# Altium schematic sheet Power.SchDoc
size A
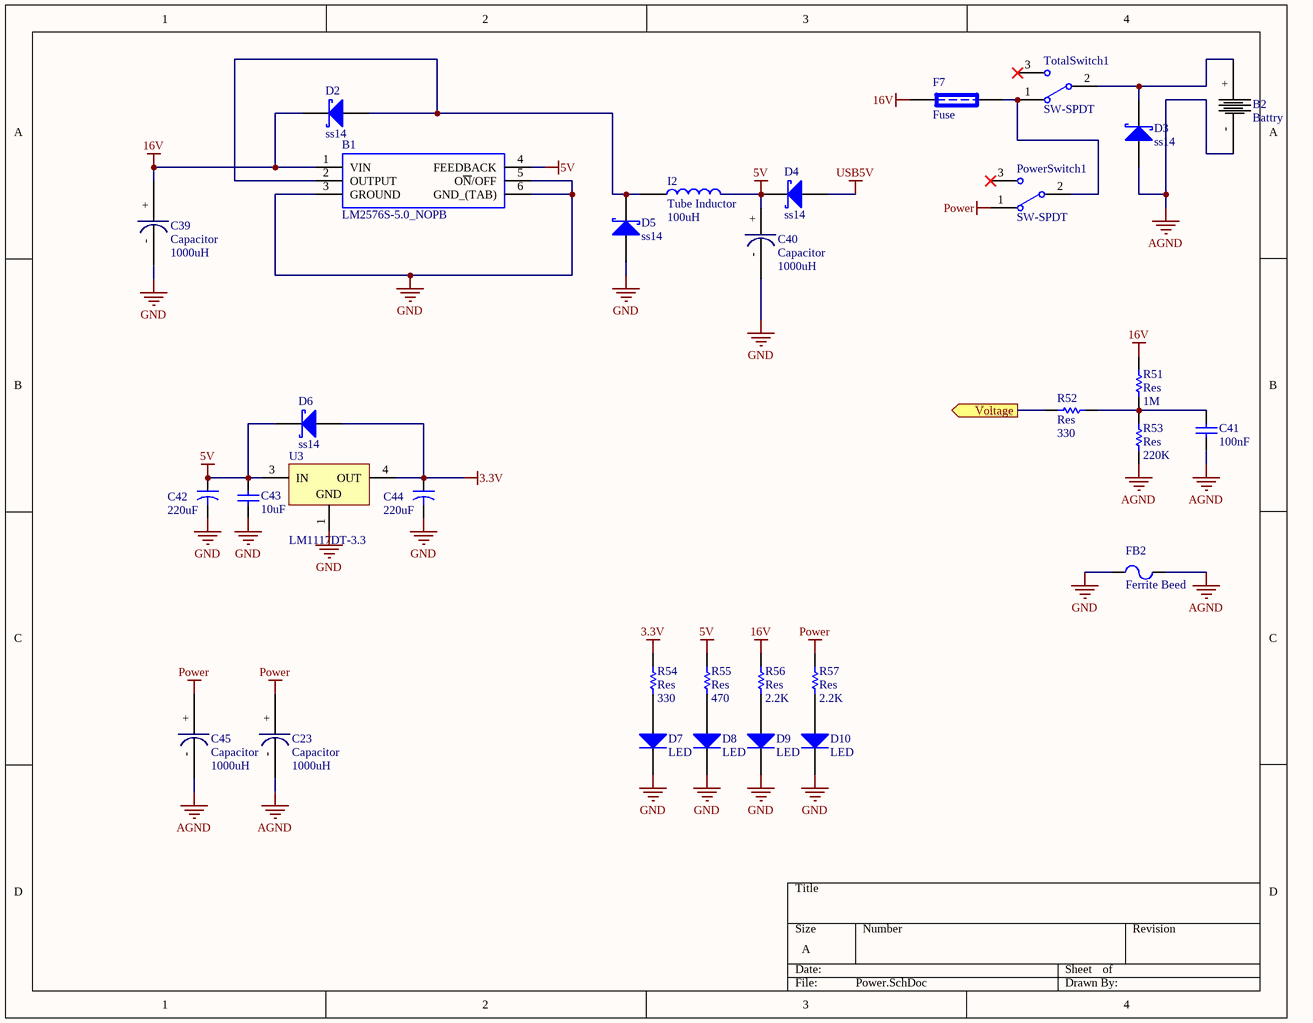
[diagram p0: Power.SchDoc]

## Parts
B1  LM2576S-5.0_NOPB  [TO170P1435X465-6N]
B2  Battry  [Battry]
C23  Capacitor  Capacitance: 1000uH  [DIPCap]
C39  Capacitor  Capacitance: 1000uH  [DIPCap]
C40  Capacitor  Capacitance: 1000uH  [DIPCap]
C41  value 100nF  [2012[0805]]  (hidden comment: Cap_UP)
C42  value 220uF  [7343]  (hidden comment: Cap_El)
C43  value 10uF  [2012[0805]]  (hidden comment: Cap_UP)
C44  value 220uF  [7343]  (hidden comment: Cap_El)
C45  Capacitor  Capacitance: 1000uH  [DIPCap]
D2  ss14  [US1m]
D3  ss14  [US1m]
D4  ss14  [US1m]
D5  ss14  [US1m]
D6  ss14  [US1m]
D7  LED  [2012[0805]]
D8  LED  [2012[0805]]
D9  LED  [2012[0805]]
D10  LED  [2012[0805]]
F7  Fuse  [3216[1206]]
FB2  Ferrite Beed  [3216[1206]]
I2  Tube Inductor  Inductance: 100uH  [Tube_Inductor]
PowerSwitch1  SW-SPDT  [KEYKHRAB]
R51  Res  value 1M  [2012[0805]]
R52  Res  value 330  [2012[0805]]
R53  Res  value 220K  [2012[0805]]
R54  Res  value 330  [2012[0805]]
R55  Res  value 470  [2012[0805]]
R56  Res  value 2.2K  [2012[0805]]
R57  Res  value 2.2K  [2012[0805]]
TotalSwitch1  SW-SPDT  [KEYKHRAB]
U3  LM1117DT-3.3  [SOT223]

## Ports
Voltage (out)

## Nets
3.3V: C44.1 D6.1(A) R54.2 U3.4(OUT)
5V: B1.4(FEEDBACK) C40.+ C42.1 C43.2 D4.2(K) D6.2(K) I2.1 R55.2 U3.3(IN)
16V: B1.1(VIN) C39.+ D2.2(K) F7.1 R51.2 R56.2
AGND: B2.- C23.- C41.1 C45.- D3.1(A) FB2.2 R53.1
GND: B1.3(GROUND) B1.5(O~{N}/OFF) B1.6(GND_(TAB)) C39.- C40.- C42.2 C43.1 C44.2 D5.1(A) D7.2(K) D8.2(K) D9.2(K) D10.2(K) FB2.1 U3.1(GND)
Power: C23.+ C45.+ PowerSwitch1.1 R57.2
USB5V: D4.1(A)
Voltage: R52.1 ; port Voltage
NetB1_2: B1.2(OUTPUT) D2.1(A) D5.2(K) I2.0
NetB2_+: B2.+ D3.2(K) TotalSwitch1.2
NetC41_2: C41.2 R51.1 R52.2 R53.2
NetD7_1: D7.1(A) R54.1
NetD8_1: D8.1(A) R55.1
NetD9_1: D9.1(A) R56.1
NetD10_1: D10.1(A) R57.1
NetF7_2: F7.2 PowerSwitch1.2 TotalSwitch1.1

Not connected (* = marked no-connect by the designer): PowerSwitch1 3(1)*; TotalSwitch1 3(1)*

## Library data of the parts
B1 = LM2576S-5.0_NOPB: SIMPLE SWITCHER 40V, 3A Low Component Count Step-Down Regulator; Manufacturer_Name: Texas Instruments; Manufacturer_Part_Number: LM2576S-5.0/NOPB; Geometry.Height: 4.65mm; Supplier_Name: RS; RS Part Number: 5333226P; Allied_Number: *; Other Part Number: *; Datasheet Link: http://docs-europe.electrocomponents.com/webdocs/0780/0900766b80780107.pdf; 3D Package: *
C23 C39 C40 C45 = DIPCap
C41 C43 = Cap_UP: Capacitor; Published: 8-Jun-2000; LatestRevisionDate: 17-Jul-2002; LatestRevisionNote: Re-released for DXP Platform.; PackageReference: RAD-0.3; Publisher: Altium Limited
C42 C44 = Cap_El: Capacitor; Published: 23-Sep-2002; PackageReference: CAPR5-4X5; Publisher: Altium Limited
D2-D6 = D Schottky: Schottky Diode; Published: 8-Jun-2000; LatestRevisionDate: 17-Jul-2002; LatestRevisionNote: Re-released for DXP Platform.; PackageReference: SMB; Publisher: Altium Limited; PackageDescription: DO-214-AA/SMB; 2 C-Bend Leads; Body 5.3 x 3.6 mm, inc. leads (LxW); Code_JEDEC: DO-214-AA
D7-D10 = Diode: 1 Amp General Purpose Rectifier; Revision 1: 11-Jul-2000: SIM Model Added.; Revision 2: 17-Jul-2002: Re-released for DXP Platform.; Package Information: Latest Revision: Aug-1999; Code - JEDEC: DO-204-AL; Published: 8-Jun-2000; Datasheet: Latest Revision: 1998; Package Reference: DO-41; Publisher: Altium Limited
FB2 = Ferrite Beed: Code_IEC: 1005; Published: 8-Jun-2000; LatestRevisionDate: 17-Jul-2002; LatestRevisionNote: Re-released for DXP Platform.; PackageReference: 0402-A; Publisher: Altium Limited; Code_JEITA: 0402
I2 = Tube_Inductor
PowerSwitch1 TotalSwitch1 = SW-SPDT: SPDT Subminiature Toggle Switch, Right Angle Mounting, Vertical Actuation; Published: 24-Mar-1999; LatestRevisionDate: 17-Dec-2003; LatestRevisionNote: Schematic revised, PCB Footprint replaced.; DatasheetDocument: 05-Dec-2000; PackageReference: TL36WW15050; Publisher: Altium Limited; ComponentLink1Description: Manufacturer Link; ComponentLink1URL: http://www.apem.com
R51-R57 = Res: Semiconductor Resistor; Published: 8-Jun-2000; LatestRevisionDate: 17-Jul-2002; LatestRevisionNote: Re-released for DXP Platform.; PackageReference: AXIAL-0.5; Publisher: Altium Limited
U3 = LM1117DT-3.3: 800mA Low-Dropout Linear Regulator, 3-pin TO-252; Manufacturer: National Semiconductor; PackageTopMarking: NSUZXYTT*LM1117*DT-3.3; PowerWise: N; CompType: LDO IC; Published: 4-Dec-2008; DatasheetVersion: Apr-2006; PackageVersion: revD, Feb-2009; PackageReference: TD03B; Publisher: Altium Limited; PackageDescription: TO252, Molded, Jedec, 6.8 x 6.10 x 2.30mm Body, 3 Lead, 2.28mm Pitch, Surface Mount; Supplier 1: Farnell; Supplier Part Number 1: 9486275; Supplier 2: Farnell; Supplier Part Number 2: 1523829; PartNumber: LM1117DT-3.3; RoHS: N; PinCount: 3; Code_JEDEC: TO-252-AA; ComponentLink1Description: LM1117 Datasheet; ComponentLink1URL: http://www.national.com/ds/LM/LM1117.pdf; ComponentLink2Description: LM1117 Web Page; ComponentLink2URL: http://www.national.com/pf/LM/LM1117.html; ComponentLink3Description: TD03B Package Page; ComponentLink3URL: http://www.national.com/packaging/folders/td03b.html
F7 = Fuse: Published: 8-Jun-2000; LatestRevisionDate: 17-Jul-2002; LatestRevisionNote: Re-released for DXP Platform.; PackageReference: PIN-W2/E2.8; Publisher: Altium Limited